# Altium schematic sheet Sheet1.SchDoc
size A4
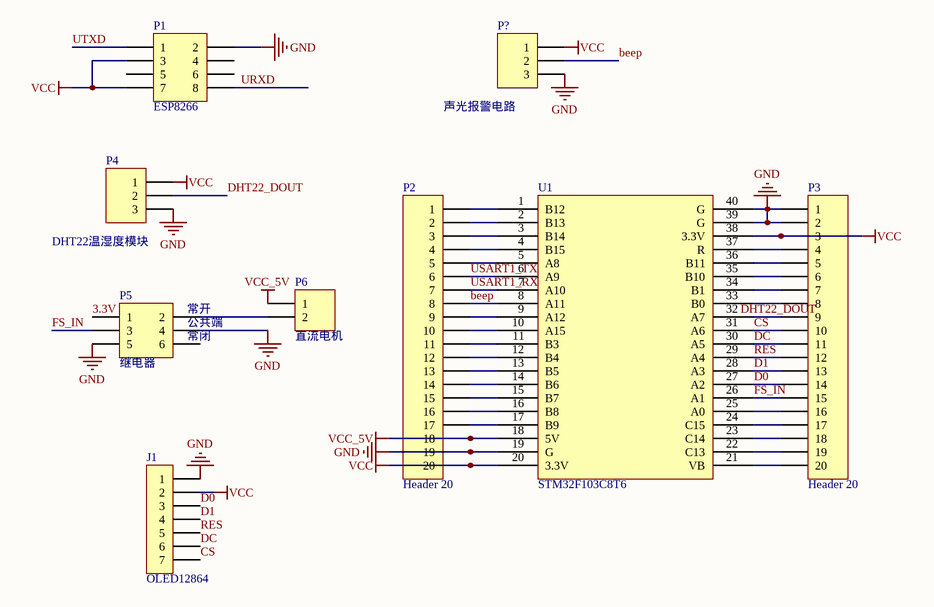
[diagram p0: Sheet1.SchDoc]

## Parts
J1  OLED12864  [PIN-7-2.54-1.0]
P1  ESP8266  [HDR2X4]
P2  Header 20  [HDR1X20]
P3  Header 20  [HDR1X20]
P4  DHT22温湿度模块  [HDR1X3]
P5  继电器  [HDR2X3]
P6  直流电机  [HDR1X2]
P?  声光报警电路  [HDR1X3]
U1  STM32F103C8T6  [STM32F103C8T6_HXB]

## Nets
GND: J1.1 P1.2 P2.19 P3.1 P3.2 P4.3 P5.4 P5.5 P?.3 U1.19(G) U1.39(G) U1.40(G)
VCC: J1.2 P1.3 P1.7 P2.20 P3.3 P4.1 P?.1 U1.20(3.3V) U1.38(3.3V)
VCC_5V: P2.18 P6.1 U1.18(5V)
3.3V: P5.1
beep: P2.8 P?.2 U1.8(A11)
CS: J1.7 P3.10 U1.31(A6)
D0: J1.3 P3.14 U1.27(A2)
D1: J1.4 P3.13 U1.28(A3)
DC: J1.6 P3.11 U1.30(A5)
DHT22_DOUT: P4.2
FS_IN: P3.15 P5.3 U1.26(A1)
RES: J1.5 P3.12 U1.29(A4)
URXD: P1.8
USART1_RX: P2.7 U1.7(A10)
USART1_TX: P2.6 U1.6(A9)
UTXD: P1.1
NetP2_1: P2.1 U1.1(B12)
NetP2_2: P2.2 U1.2(B13)
NetP2_3: P2.3 U1.3(B14)
NetP2_4: P2.4 U1.4(B15)
NetP2_5: P2.5 U1.5(A8)
NetP2_9: P2.9 U1.9(A12)
NetP2_10: P2.10 U1.10(A15)
NetP2_11: P2.11 U1.11(B3)
NetP2_12: P2.12 U1.12(B4)
NetP2_13: P2.13 U1.13(B5)
NetP2_14: P2.14 U1.14(B6)
NetP2_15: P2.15 U1.15(B7)
NetP2_16: P2.16 U1.16(B8)
NetP2_17: P2.17 U1.17(B9)
NetP3_4: P3.4 U1.37(R)
NetP3_5: P3.5 U1.36(B11)
NetP3_6: P3.6 U1.35(B10)
NetP3_7: P3.7 U1.34(B1)
NetP3_8: P3.8 U1.33(B0)
NetP3_9: P3.9 U1.32(A7)
NetP3_16: P3.16 U1.25(A0)
NetP3_17: P3.17 U1.24(C15)
NetP3_18: P3.18 U1.23(C14)
NetP3_19: P3.19 U1.22(C13)
NetP3_20: P3.20 U1.21(VB)
NetP5_2: P5.2 P6.2

Not connected (* = marked no-connect by the designer): P1 4 5 6; P5 6

## Notes on the sheet
- (near P5) 常开
- (near P5) 公共端
- (near P5) 常闭
- Labels drawn without touching a wire or pin: DHT22_DOUT

## Library data of the parts
J1 = HDR1x7: Connector
P1 = Header 4X2: Header, 4-Pin, Dual row; LatestRevisionDate: 17-Jul-2002; LatestRevisionNote: Re-released for DXP Platform.; Publisher: Altium Limited
P2 P3 = Header 20: Header, 20-Pin; LatestRevisionDate: 17-Jul-2002; LatestRevisionNote: Re-released for DXP Platform.; Publisher: Altium Limited
P4 P? = Header 3: Header, 3-Pin; LatestRevisionDate: 17-Jul-2002; LatestRevisionNote: Re-released for DXP Platform.; Publisher: Altium Limited
P5 = Header 3X2: Header, 3-Pin, Dual row; LatestRevisionDate: 17-Jul-2002; LatestRevisionNote: Re-released for DXP Platform.; Publisher: Altium Limited
P6 = Header 2: Header, 2-Pin; LatestRevisionDate: 17-Jul-2002; LatestRevisionNote: Re-released for DXP Platform.; Publisher: Altium Limited
U1 = Component_1